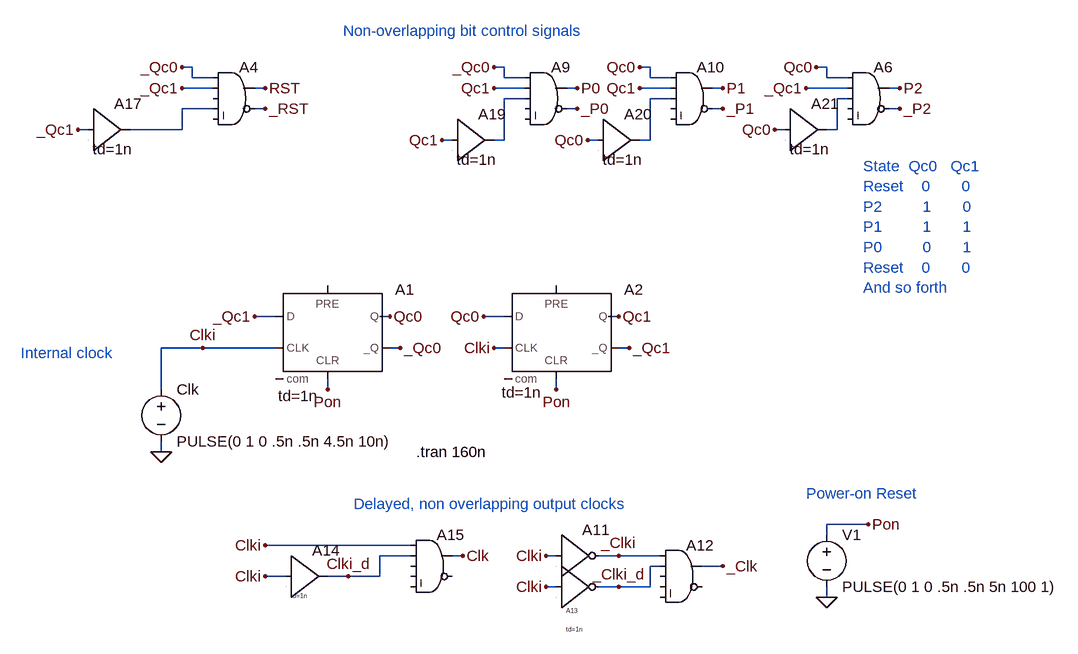
[diagram p0: schematic StateGen.asc]
StateGen.asc, the LTspice schematic file:
Version 4
SHEET 1 880 716
WIRE -768 -272 -784 -272
WIRE -288 -272 -304 -272
WIRE -64 -272 -80 -272
WIRE 208 -272 192 -272
WIRE -768 -256 -768 -272
WIRE -736 -256 -768 -256
WIRE -288 -256 -288 -272
WIRE -256 -256 -288 -256
WIRE -64 -256 -64 -272
WIRE -32 -256 -64 -256
WIRE 208 -256 208 -272
WIRE 240 -256 208 -256
WIRE -736 -240 -784 -240
WIRE -656 -240 -672 -240
WIRE -256 -240 -304 -240
WIRE -176 -240 -192 -240
WIRE -32 -240 -80 -240
WIRE 48 -240 32 -240
WIRE 240 -240 176 -240
WIRE 320 -240 304 -240
WIRE -256 -224 -288 -224
WIRE -32 -224 -64 -224
WIRE 240 -224 224 -224
WIRE -736 -208 -784 -208
WIRE -656 -208 -672 -208
WIRE -176 -208 -192 -208
WIRE 48 -208 32 -208
WIRE 320 -208 304 -208
WIRE -928 -176 -944 -176
WIRE -784 -176 -784 -208
WIRE -784 -176 -864 -176
WIRE 144 -176 128 -176
WIRE 224 -176 224 -224
WIRE 224 -176 208 -176
WIRE -368 -160 -384 -160
WIRE -288 -160 -288 -224
WIRE -288 -160 -304 -160
WIRE -144 -160 -160 -160
WIRE -64 -160 -64 -224
WIRE -64 -160 -80 -160
WIRE -640 112 -672 112
WIRE -464 112 -480 112
WIRE -288 112 -320 112
WIRE -112 112 -128 112
WIRE -752 160 -816 160
WIRE -640 160 -752 160
WIRE -448 160 -464 160
WIRE -288 160 -304 160
WIRE -96 160 -112 160
WIRE -816 224 -816 160
WIRE -560 224 -560 208
WIRE -208 224 -208 208
WIRE -816 320 -816 304
WIRE 272 432 208 432
WIRE 208 448 208 432
WIRE -432 464 -656 464
WIRE -432 480 -480 480
WIRE -352 480 -368 480
WIRE -208 480 -224 480
WIRE -112 480 -144 480
WIRE -48 480 -112 480
WIRE -48 496 -64 496
WIRE 48 496 16 496
WIRE -624 512 -656 512
WIRE -528 512 -560 512
WIRE -480 512 -480 480
WIRE -480 512 -528 512
WIRE -208 528 -224 528
WIRE -112 528 -144 528
WIRE -64 528 -64 496
WIRE -64 528 -112 528
WIRE 208 544 208 528
FLAG -816 320 0
FLAG -448 160 _Qc0
FLAG -96 160 _Qc1
FLAG -464 112 Qc0
FLAG -112 112 Qc1
FLAG -752 160 Clki
FLAG 272 432 Pon
FLAG 208 544 0
FLAG -560 224 Pon
FLAG -208 224 Pon
FLAG 320 -240 P2
FLAG 48 -240 P1
FLAG -176 -240 P0
FLAG -784 -272 _Qc0
FLAG -784 -240 _Qc1
FLAG -304 -272 _Qc0
FLAG -304 -240 Qc1
FLAG -80 -240 Qc1
FLAG -80 -272 Qc0
FLAG 48 496 _Clk
FLAG -352 480 Clk
FLAG -656 512 Clki
FLAG -224 480 Clki
FLAG -224 528 Clki
FLAG -656 464 Clki
FLAG 320 -208 _P2
FLAG 48 -208 _P1
FLAG -176 -208 _P0
FLAG -528 512 Clki_d
FLAG -112 480 _Clki
FLAG -304 160 Clki
FLAG 192 -272 Qc0
FLAG -656 -240 RST
FLAG -656 -208 _RST
FLAG -944 -176 _Qc1
FLAG -384 -160 Qc1
FLAG -160 -160 Qc0
FLAG 128 -176 Qc0
FLAG -112 528 _Clki_d
FLAG 176 -240 _Qc1
FLAG -320 112 Qc0
FLAG -672 112 _Qc1
SYMBOL Digital\\dflop -560 64 R0
WINDOW 3 -76 170 Left 2
SYMATTR Value td=1n
SYMATTR InstName A1
SYMBOL Digital\\dflop -208 64 R0
WINDOW 3 -84 165 Left 2
SYMATTR Value td=1n
SYMATTR InstName A2
SYMBOL voltage -816 208 R0
WINDOW 123 0 0 Left 0
WINDOW 39 0 0 Left 0
SYMATTR InstName Clk
SYMATTR Value PULSE(0 1 0 .5n .5n 4.5n 10n)
SYMBOL voltage 208 432 R0
WINDOW 123 0 0 Left 0
WINDOW 39 0 0 Left 0
SYMATTR InstName V1
SYMATTR Value PULSE(0 1 0 .5n .5n 5n 100 1)
SYMBOL Digital\\and -704 -288 R0
SYMATTR InstName A4
SYMBOL Digital\\and -224 -288 R0
SYMATTR InstName A9
SYMBOL Digital\\and 0 -288 R0
SYMATTR InstName A10
SYMBOL Digital\\inv -208 416 R0
SYMATTR InstName A11
SYMBOL Digital\\and -16 448 R0
SYMATTR InstName A12
SYMBOL Digital\\inv -208 464 R0
WINDOW 0 15 101 Left 0
WINDOW 3 15 129 Left 0
SYMATTR InstName A13
SYMATTR Value td=1n
SYMBOL Digital\\buf1 -624 448 R0
WINDOW 3 7 94 Left 0
SYMATTR Value td=1n
SYMATTR InstName A14
SYMBOL Digital\\and -400 432 R0
SYMATTR InstName A15
SYMBOL Digital\\and 272 -288 R0
SYMATTR InstName A6
SYMBOL Digital\\buf1 -928 -240 R0
WINDOW 3 7 94 Left 2
SYMATTR Value td=1n
SYMATTR InstName A17
SYMBOL Digital\\buf1 -368 -224 R0
WINDOW 3 7 94 Left 2
SYMATTR Value td=1n
SYMATTR InstName A19
SYMBOL Digital\\buf1 -144 -224 R0
WINDOW 3 7 94 Left 2
SYMATTR Value td=1n
SYMATTR InstName A20
SYMBOL Digital\\buf1 144 -240 R0
WINDOW 3 7 94 Left 2
SYMATTR Value td=1n
SYMATTR InstName A21
TEXT -424 320 Left 2 !.tran 160n
TEXT -520 400 Left 2 ;Delayed, non overlapping output clocks
TEXT -1032 168 Left 2 ;Internal clock
TEXT -536 -328 Left 2 ;Non-overlapping bit control signals
TEXT 176 384 Left 2 ;Power-on Reset
TEXT 264 -120 Left 2 ;State  Qc0   Qc1\nReset    0       0  \nP2         1       0      \nP1         1       1      \nP0         0       1     \nReset    0       0     \nAnd so forth

The netlist it stands for:
* StateGen.asc
A1 _Qc1 0 Clki 0 Pon _Qc0 Qc0 0 DFLOP td=1n
A2 Qc0 0 Clki 0 Pon _Qc1 Qc1 0 DFLOP td=1n
V§Clk Clki 0 PULSE(0 1 0 .5n .5n 4.5n 10n)
V1 Pon 0 PULSE(0 1 0 .5n .5n 5n 100 1)
A4 _Qc0 _Qc1 0 N004 0 _RST RST 0 AND
A9 _Qc0 Qc1 N001 0 0 _P0 P0 0 AND
A10 Qc0 Qc1 N002 0 0 _P1 P1 0 AND
A11 Clki 0 0 0 0 _Clki 0 0 BUF
A12 _Clki _Clki_d 0 0 0 0 _Clk 0 AND
A13 Clki 0 0 0 0 _Clki_d 0 0 BUF td=1n
A14 Clki 0 0 0 0 0 Clki_d 0 BUF td=1n
A15 Clki Clki_d 0 0 0 0 Clk 0 AND
A6 Qc0 _Qc1 N003 0 0 _P2 P2 0 AND
A17 _Qc1 0 0 0 0 0 N004 0 BUF td=1n
A19 Qc1 0 0 0 0 0 N001 0 BUF td=1n
A20 Qc0 0 0 0 0 0 N002 0 BUF td=1n
A21 Qc0 0 0 0 0 0 N003 0 BUF td=1n
.tran 160n
* Delayed, non overlapping output clocks
* Internal clock
* Non-overlapping bit control signals
* Power-on Reset
* State  Qc0   Qc1
* Reset    0       0
* P2         1       0
* P1         1       1
* P0         0       1
* Reset    0       0
* And so forth
.backanno
.end